# Altium schematic sheet EFM.SchDoc
size A4
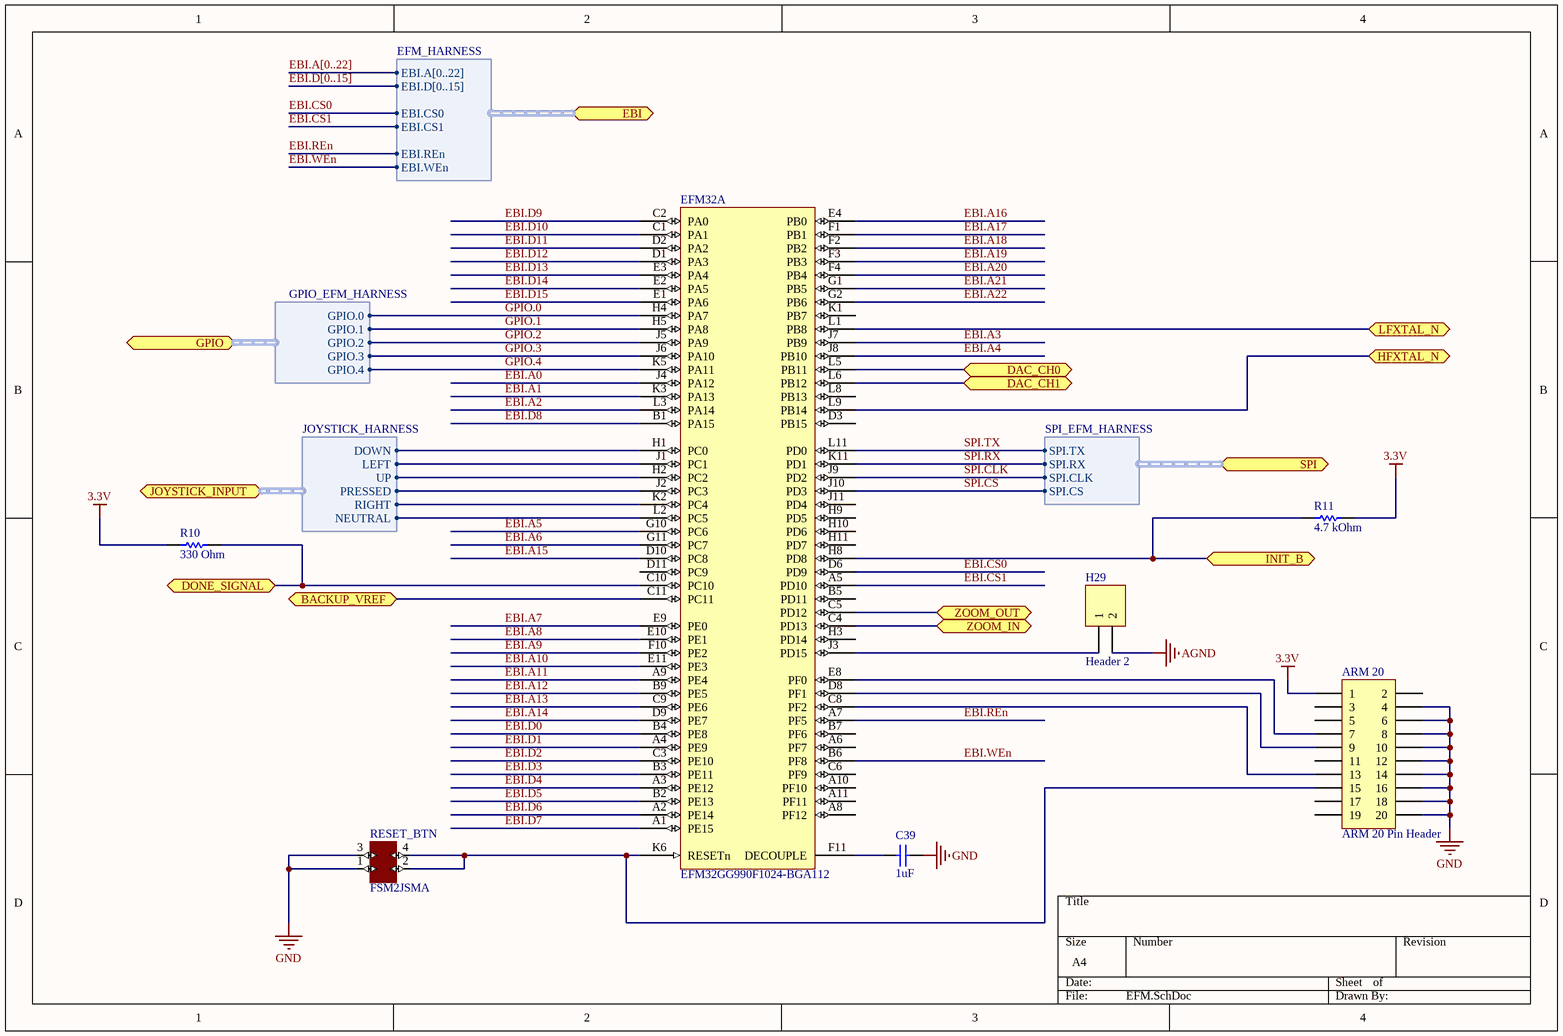
[diagram p0: EFM.SchDoc]

## Parts
ARM_20  ARM 20 Pin Header  [HDR2X10]
C39  1uF  [CAPC0603(1608)100_M]
EFM32  EFM32GG990F1024-BGA112  [ENMR-BGA112]  (part A of 2)
H29  Header 2  [HDR1X2]
R10  330 Ohm  [RESC0603(1608)_M]
R11  4.7 kOhm  [RESC0603(1608)_M]
RESET_BTN  FSM2JSMA  [Button]

## Ports
BACKUP_VREF, DAC_CH0, DAC_CH1, DONE_SIGNAL, EBI (harness EFM_HARNESS), GPIO (harness GPIO_EFM_HARNESS), HFXTAL_N, INIT_B, JOYSTICK_INPUT (harness JOYSTICK_HARNESS), LFXTAL_N, SPI (harness SPI_EFM_HARNESS), ZOOM_IN, ZOOM_OUT

## Harnesses
JOYSTICK_HARNESS: DOWN, LEFT, UP, PRESSED, RIGHT, NEUTRAL
EFM_HARNESS: EBI.A[0..22], EBI.D[0..15], EBI.CS0, EBI.CS1, EBI.REn, EBI.WEn
GPIO_EFM_HARNESS: GPIO.0, GPIO.1, GPIO.2, GPIO.3, GPIO.4
SPI_EFM_HARNESS: SPI.TX, SPI.RX, SPI.CLK, SPI.CS

## Nets
3.3V: ARM_20.1 R10.1 R11.2
AGND: H29.2
GND: ARM_20.4 ARM_20.6 ARM_20.8 ARM_20.10 ARM_20.12 ARM_20.14 ARM_20.16 ARM_20.18 ARM_20.20 C39.2 RESET_BTN.1 RESET_BTN.3
BACKUP_VREF: EFM32.C11(PC11) ; port BACKUP_VREF
DAC_CH0: EFM32.L5(PB11) ; port DAC_CH0
DAC_CH1: EFM32.L6(PB12) ; port DAC_CH1
DONE_SIGNAL: EFM32.C10(PC10) R10.2 ; port DONE_SIGNAL
EBI.A0: EFM32.J4(PA12)
EBI.A1: EFM32.K3(PA13)
EBI.A2: EFM32.L3(PA14)
EBI.A3: EFM32.J7(PB9)
EBI.A4: EFM32.J8(PB10)
EBI.A5: EFM32.G10(PC6)
EBI.A6: EFM32.G11(PC7)
EBI.A7: EFM32.E9(PE0)
EBI.A8: EFM32.E10(PE1)
EBI.A9: EFM32.F10(PE2)
EBI.A10: EFM32.E11(PE3)
EBI.A11: EFM32.A9(PE4)
EBI.A12: EFM32.B9(PE5)
EBI.A13: EFM32.C9(PE6)
EBI.A14: EFM32.D9(PE7)
EBI.A15: EFM32.D10(PC8)
EBI.A16: EFM32.E4(PB0)
EBI.A17: EFM32.F1(PB1)
EBI.A18: EFM32.F2(PB2)
EBI.A19: EFM32.F3(PB3)
EBI.A20: EFM32.F4(PB4)
EBI.A21: EFM32.G1(PB5)
EBI.A22: EFM32.G2(PB6)
EBI.CS0: EFM32.D6(PD9) ; port EBI.EBI.CS0
EBI.CS1: EFM32.A5(PD10) ; port EBI.EBI.CS1
EBI.D0: EFM32.B4(PE8)
EBI.D1: EFM32.A4(PE9)
EBI.D2: EFM32.C3(PE10)
EBI.D3: EFM32.B3(PE11)
EBI.D4: EFM32.A3(PE12)
EBI.D5: EFM32.B2(PE13)
EBI.D6: EFM32.A2(PE14)
EBI.D7: EFM32.A1(PE15)
EBI.D8: EFM32.B1(PA15)
EBI.D9: EFM32.C2(PA0)
EBI.D10: EFM32.C1(PA1)
EBI.D11: EFM32.D2(PA2)
EBI.D12: EFM32.D1(PA3)
EBI.D13: EFM32.E3(PA4)
EBI.D14: EFM32.E2(PA5)
EBI.D15: EFM32.E1(PA6)
EBI.REn: EFM32.A7(PF5) ; port EBI.EBI.REn
EBI.WEn: EFM32.B6(PF8) ; port EBI.EBI.WEn
GPIO.0: EFM32.H4(PA7) ; port GPIO.GPIO.0
GPIO.1: EFM32.H5(PA8) ; port GPIO.GPIO.1
GPIO.2: EFM32.J5(PA9) ; port GPIO.GPIO.2
GPIO.3: EFM32.J6(PA10) ; port GPIO.GPIO.3
GPIO.4: EFM32.K5(PA11) ; port GPIO.GPIO.4
HFXTAL_N: EFM32.L9(PB14) ; port HFXTAL_N
INIT_B: EFM32.H8(PD8) R11.1 ; port INIT_B
LFXTAL_N: EFM32.L1(PB8) ; port LFXTAL_N
SPI.CLK: EFM32.J9(PD2) ; port SPI.SPI.CLK
SPI.CS: EFM32.J10(PD3) ; port SPI.SPI.CS
SPI.RX: EFM32.K11(PD1) ; port SPI.SPI.RX
SPI.TX: EFM32.L11(PD0) ; port SPI.SPI.TX
ZOOM_IN: EFM32.C4(PD13) ; port ZOOM_IN
ZOOM_OUT: EFM32.C5(PD12) ; port ZOOM_OUT
NetARM_20_7: ARM_20.7 EFM32.E8(PF0)
NetARM_20_9: ARM_20.9 EFM32.D8(PF1)
NetARM_20_13: ARM_20.13 EFM32.C8(PF2)
NetARM_20_15: ARM_20.15 EFM32.K6(RESETn) RESET_BTN.2 RESET_BTN.4
NetC39_1: C39.1 EFM32.F11(DECOUPLE)
NetEFM32_H1: EFM32.H1(PC0) ; port JOYSTICK_INPUT.DOWN
NetEFM32_H2: EFM32.H2(PC2) ; port JOYSTICK_INPUT.UP
NetEFM32_J1: EFM32.J1(PC1) ; port JOYSTICK_INPUT.LEFT
NetEFM32_J2: EFM32.J2(PC3) ; port JOYSTICK_INPUT.PRESSED
NetEFM32_J3: EFM32.J3(PD15) H29.1
NetEFM32_K2: EFM32.K2(PC4) ; port JOYSTICK_INPUT.RIGHT
NetEFM32_L2: EFM32.L2(PC5) ; port JOYSTICK_INPUT.NEUTRAL

Not connected (* = marked no-connect by the designer): ARM_20 2 3 5 11 17 19; EFM32 A6(PF7) A8(PF12) A10(PF10) A11(PF11) B5(PD11) B7(PF6) C6(PF9) D3(PB15) D11(PC9) H3(PD14) H9(PD5) H10(PD6) H11(PD7) J11(PD4) K1(PB7) L8(PB13)

## Buses and harness runs
bus EBI.A[0..22]
bus EBI.D[0..15]

## Library data of the parts
ARM_20 = Header 10X2: Header, 10-Pin, Dual row; LatestRevisionDate: 17-Jul-2002; LatestRevisionNote: Re-released for DXP Platform.; Publisher: Altium Limited
C39 = CMP-1035-00001-1: CAP 0.5pF 10V Â±0.1pF 0603 (1608 Metric) Thickness 1mm SMD; Case-EIA: 0603; Case-Metric: 1608; Max Thickness: 1 mm; Tolerance: Â±0.1pF; Value: 1uF; Technology: SMT; Rated Voltage: 10 V
EFM32 = EFM32GG990F1024-BGA112: EFM32 Giant Gecko, M3 ARM Cortex CPU, 1024 KB Flash, 128 KB RAM, 1.85 - 3.8 V Supply, 48 MHz Max Speed, -40 to 85 degC, 112-Pin BGA, RoHS Compliant; Flash (KB): 1024; GPIO: 87; LCD: 8x34; LESENSE: Y; Max Speed (MHz): 48; OPAMPS: 3; RAM (KB): 128; DatasheetVersion: Rev 1.00; PackageVersion: Rev. 97SPP01315A_X03_06Jun11; PackageReference: BGA112; PackageDescription: 112-Pin Ball Grid Array, Body 10 x 10 mm, Pitch 0.8 mm; Supplier 1: Digi-Key; Supplier Part Number 1: 914-1051-2-ND; Supplier 2: Digi-Key; Supplier Part Number 2: 914-1051-1-ND; Supplier 3: Digi-Key; Supplier Part Number 3: 914-1051-6-ND; Supplier 4: Mouser; Supplier Part Number 4: 904-EFM32GG990F1024; ARM Cortex CPU: M3; Subcategory: EFM32 Giant Gecko; Supply Voltage (V): 1.85 - 3.8; USB: Y; Mounting Technology: Surface Mount; Generic Part Number: EFM32GG990; PartNumber: EFM32GG990F1024-BGA112; ComponentLink1Description: Manufacturer URL; ComponentLink1URL: http://www.energymicro.com/; ComponentLink2Description: Datasheet; ComponentLink2URL: http://cdn.energymicro.com/dl/devices/pdf/d0046_efm32gg990_datasheet.pdf; ComponentLink3Description: Package Specification; ComponentLink3URL: http://cdn.energymicro.com/dl/devices/pdf/d0007_efm32g290_datasheet.pdf
H29 = Header 2: Header, 2-Pin; LatestRevisionDate: 17-Jul-2002; LatestRevisionNote: Re-released for DXP Platform.; Publisher: Altium Limited
R10 R11 = CMP-1012-00002-1: 1R 0.1W 5% 0603 (1608 Metric)  SMD; Case-Metric: 1608; Case-EIA: 0603; Power: 0.1 W; Technology: SMT; Tolerance: 5 %
  R10: Value: 330 Ohm
  R11: Value: 4.7 kOhm
RESET_BTN = switch-button